# EAGLE design bal_part (EAGLE 7.2.0)
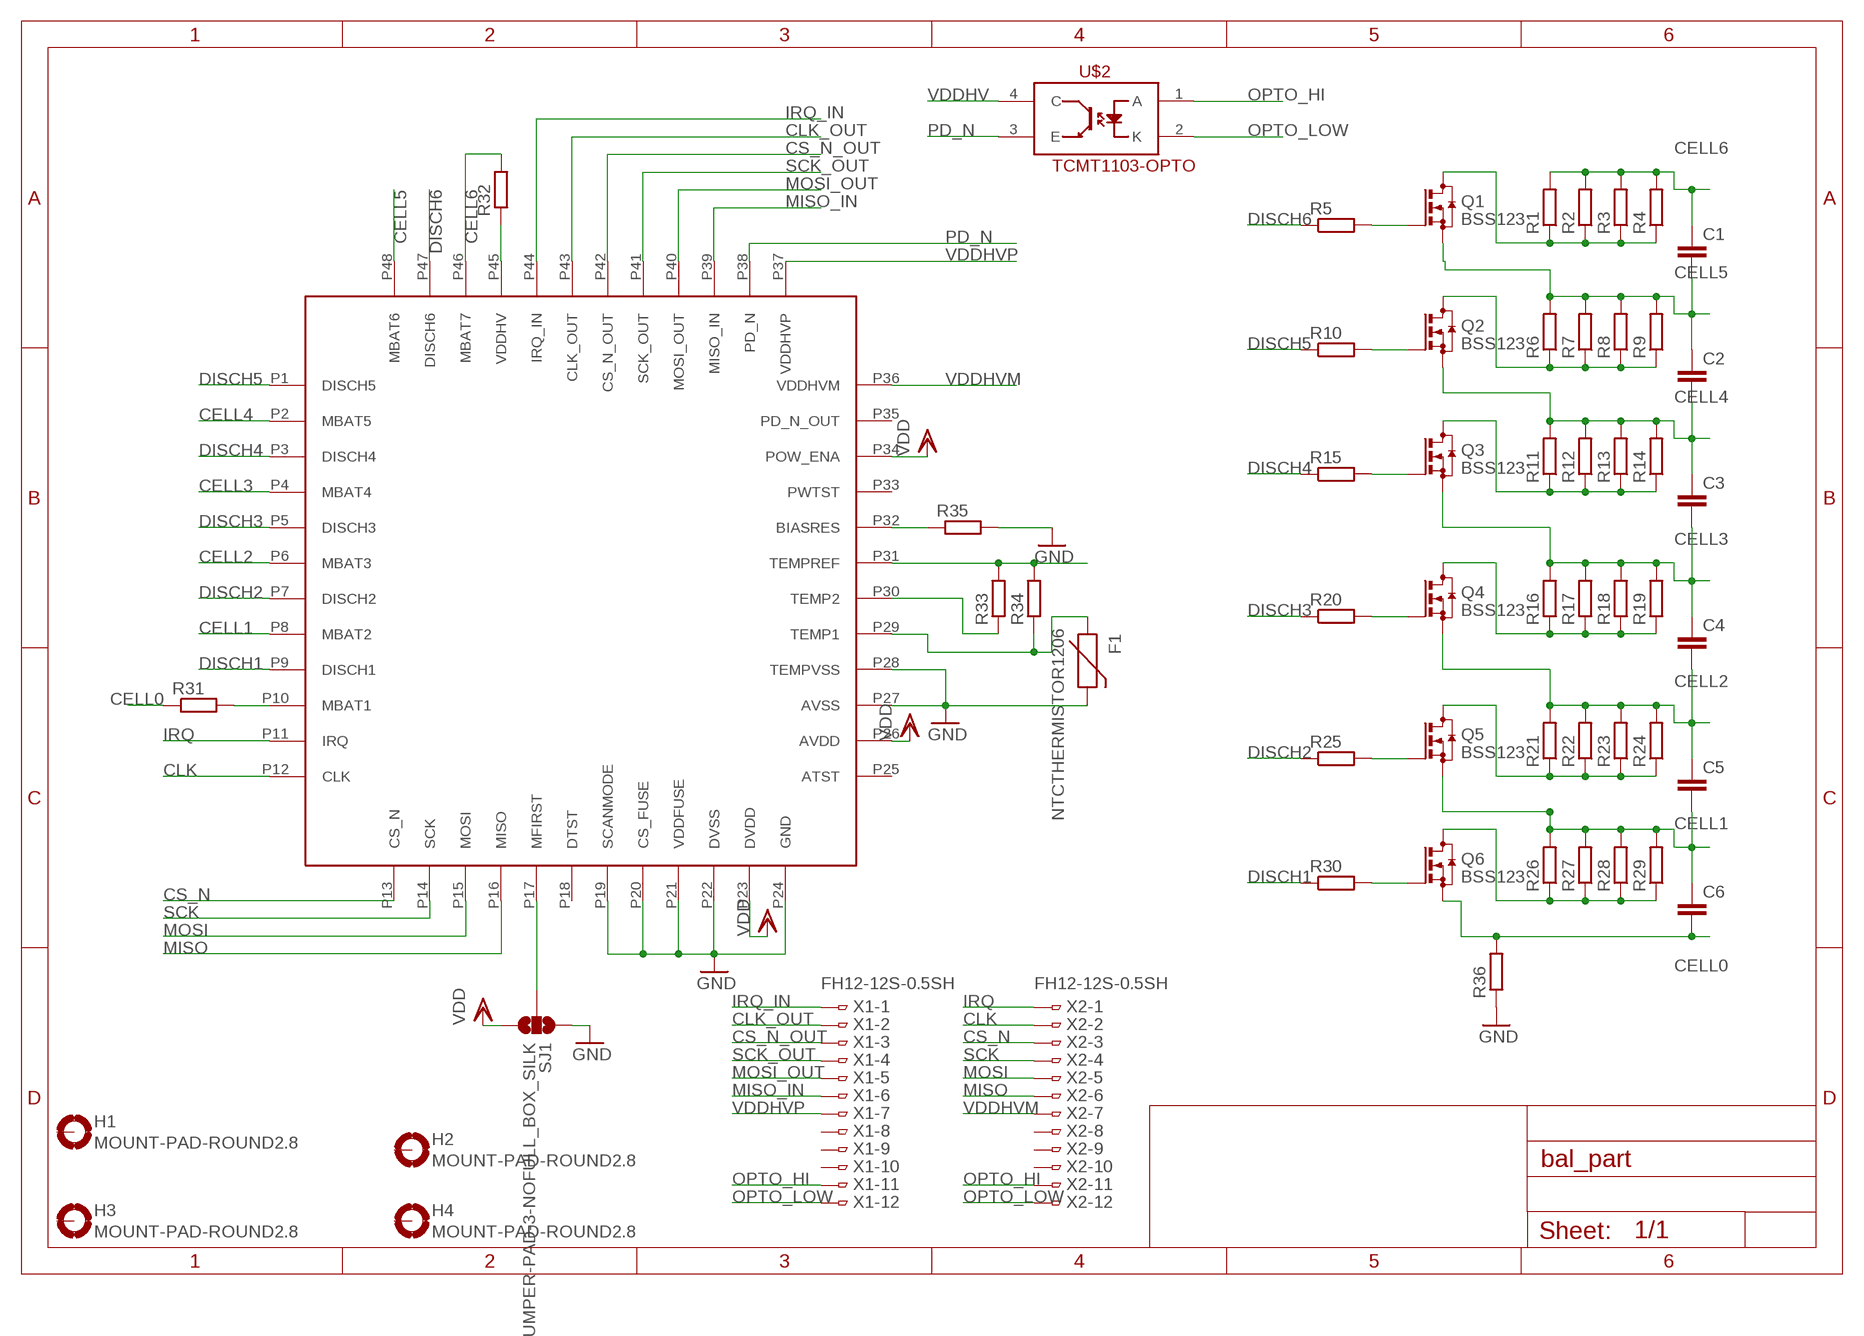
[diagram p0: schematic, sheet 1]

## Parts
C1  C-EUC0805  [C0805]
C2  C-EUC0805  [C0805]
C3  C-EUC0805  [C0805]
C4  C-EUC0805  [C0805]
C5  C-EUC0805  [C0805]
C6  C-EUC0805  [C0805]
F1  NTCTHERMISTOR1206  PTCTHERMISTOR1206  [PTC-1206]
H1  MOUNT-PAD-ROUND2.8  [2,8-PAD]
H2  MOUNT-PAD-ROUND2.8  [2,8-PAD]
H3  MOUNT-PAD-ROUND2.8  [2,8-PAD]
H4  MOUNT-PAD-ROUND2.8  [2,8-PAD]
Q1  BSS123  [SOT23]
Q2  BSS123  [SOT23]
Q3  BSS123  [SOT23]
Q4  BSS123  [SOT23]
Q5  BSS123  [SOT23]
Q6  BSS123  [SOT23]
R1  R-EU_R1206  [R1206]
R2  R-EU_R1206  [R1206]
R3  R-EU_R1206  [R1206]
R4  R-EU_R1206  [R1206]
R5  R-EU_R0805  [R0805]
R6  R-EU_R1206  [R1206]
R7  R-EU_R1206  [R1206]
R8  R-EU_R1206  [R1206]
R9  R-EU_R1206  [R1206]
R10  R-EU_R0805  [R0805]
R11  R-EU_R1206  [R1206]
R12  R-EU_R1206  [R1206]
R13  R-EU_R1206  [R1206]
R14  R-EU_R1206  [R1206]
R15  R-EU_R0805  [R0805]
R16  R-EU_R1206  [R1206]
R17  R-EU_R1206  [R1206]
R18  R-EU_R1206  [R1206]
R19  R-EU_R1206  [R1206]
R20  R-EU_R0805  [R0805]
R21  R-EU_R1206  [R1206]
R22  R-EU_R1206  [R1206]
R23  R-EU_R1206  [R1206]
R24  R-EU_R1206  [R1206]
R25  R-EU_R0805  [R0805]
R26  R-EU_R1206  [R1206]
R27  R-EU_R1206  [R1206]
R28  R-EU_R1206  [R1206]
R29  R-EU_R1206  [R1206]
R30  R-EU_R0805  [R0805]
R31  R-EU_R0805  [R0805]
R32  R-EU_R0805  [R0805]
R33  R-EU_R0805  [R0805]
R34  R-EU_R0805  [R0805]
R35  R-EU_R0805  [R0805]
R36  R-EU_R0805  [R0805]
SJ1  JUMPER-PAD-3-NOFULL_BOX_SILK  [PAD-JUMPER-3-NO_YES_SILK_FULL_BOX]
U$1  ATA6870  [QFN48]
U$2  TCMT1103-OPTO  [SSOP-4]
X1  FH12-12S-0.5SH  [FH12-12S-0.5SH]
X2  FH12-12S-0.5SH  [FH12-12S-0.5SH]

## Nets
CELL0: C6.2 Q6.2(S) R31.1 R36.2
CELL1: C5.2 C6.1 Q5.2(S) R26.2 R27.2 R28.2 R29.2 U$1.P8(MBAT2)
CELL2: C4.2 C5.1 Q4.2(S) R21.2 R22.2 R23.2 R24.2 U$1.P6(MBAT3)
CELL3: C3.2 C4.1 Q3.2(S) R16.2 R17.2 R18.2 R19.2 U$1.P4(MBAT4)
CELL4: C2.2 C3.1 Q2.2(S) R11.2 R12.2 R13.2 R14.2 U$1.P2(MBAT5)
CELL5: C1.2 C2.1 Q1.2(S) R6.2 R7.2 R8.2 R9.2 U$1.P48(MBAT6)
CELL6: C1.1 R1.2 R2.2 R3.2 R4.2 R32.2 U$1.P46(MBAT7)
CLK: U$1.P12(CLK) X2.2
CLK_OUT: U$1.P43(CLK_OUT) X1.2
CS_N: U$1.P13(CS_N) X2.3
CS_N_OUT: U$1.P42(CS_N_OUT) X1.3
DISCH1: R30.1 U$1.P9(DISCH1)
DISCH2: R25.1 U$1.P7(DISCH2)
DISCH3: R20.1 U$1.P5(DISCH3)
DISCH4: R15.1 U$1.P3(DISCH4)
DISCH5: R10.1 U$1.P1(DISCH5)
DISCH6: R5.1 U$1.P47(DISCH6)
GND: F1.2 R35.2 R36.1 SJ1.1 U$1.P19(SCANMODE) U$1.P20(CS_FUSE) U$1.P21(VDDFUSE) U$1.P22(DVSS) U$1.P24(GND) U$1.P27(AVSS) U$1.P28(TEMPVSS)
IRQ: U$1.P11(IRQ) X2.1
IRQ_IN: U$1.P44(IRQ_IN) X1.1
MISO: U$1.P16(MISO) X2.6
MISO_IN: U$1.P39(MISO_IN) X1.6
MOSI: U$1.P15(MOSI) X2.5
MOSI_OUT: U$1.P40(MOSI_OUT) X1.5
N$1: Q1.3(D) R1.1 R2.1 R3.1 R4.1
N$2: Q1.1(G) R5.2
N$3: Q2.3(D) R6.1 R7.1 R8.1 R9.1
N$4: Q2.1(G) R10.2
N$5: Q3.3(D) R11.1 R12.1 R13.1 R14.1
N$6: Q3.1(G) R15.2
N$7: Q4.3(D) R16.1 R17.1 R18.1 R19.1
N$8: Q4.1(G) R20.2
N$9: Q5.3(D) R21.1 R22.1 R23.1 R24.1
N$10: Q5.1(G) R25.2
N$11: Q6.3(D) R26.1 R27.1 R28.1 R29.1
N$12: Q6.1(G) R30.2
N$13: R31.2 U$1.P10(MBAT1)
N$15: R33.2 R34.2 U$1.P31(TEMPREF)
N$16: R33.1 U$1.P30(TEMP2)
N$17: F1.1 R34.1 U$1.P29(TEMP1)
N$18: R35.1 U$1.P32(BIASRES)
N$19: SJ1.2 U$1.P17(MFIRST)
OPTO_HI: U$2.1(A) X1.11 X2.11
OPTO_LOW: U$2.2(K) X1.12 X2.12
PD_N: U$1.P38(PD_N) U$2.3(E)
SCK: U$1.P14(SCK) X2.4
SCK_OUT: U$1.P41(SCK_OUT) X1.4
VDD: SJ1.3 U$1.P23(DVDD) U$1.P26(AVDD) U$1.P34(POW_ENA)
VDDHV: R32.1 U$1.P45(VDDHV) U$2.4(C)
VDDHVM: U$1.P36(VDDHVM) X2.7
VDDHVP: U$1.P37(VDDHVP) X1.7
Unconnected: H1.B2,8(MOUNT) H2.B2,8(MOUNT) H3.B2,8(MOUNT) H4.B2,8(MOUNT) U$1.P18(DTST) U$1.P25(ATST) U$1.P33(PWTST) U$1.P35(PD_N_OUT) X1.8 X1.9 X1.10 X2.8 X2.9 X2.10

## Library data of the parts
C1-C6 = resistor:C-EU: CAPACITOR, European symbol
F1 = SparkFun-PowerIC:PTC: Resettable Fuse PTC Resettable Fuse. Spark Fun Electronics SKU : COM-08357; PROD_ID: RES-08585
H1-H4 = holes:MOUNT-PAD-ROUND: MOUNTING PAD, round
Q1-Q6 = transistor-small-signal:BSS123: N-CHANNEL MOS FET
R1-R4 R6-R9 R11-R14 R16-R19 R21-R24 R26-R29 = rcl:R-EU_: RESISTOR, European symbol
R5 R10 R15 R20 R25 R30-R36 = resistor:R-EU_: RESISTOR, European symbol
SJ1 = SparkFun-Passives:JUMPER-PAD-3-NO
U$1 = myLib:ATA6870: ATA6870-PLQW Battery Management 48QFN
U$2 = SparkFun-DiscreteSemi:TCMT1103-OPTO: Optoisolator- NPN output
X1 X2 = con-hirose:FH12-12S-0.5S: 0.5mm Pitch Connectors For FPC/FFC Source: Data sheet <http://www.hirose.co.jp/cataloge_hp/e58605370.pdf>; MPN: FH12-12S-0.5SH(55); OC_FARNELL: 1324542; OC_NEWARK: 34M6155

## Board
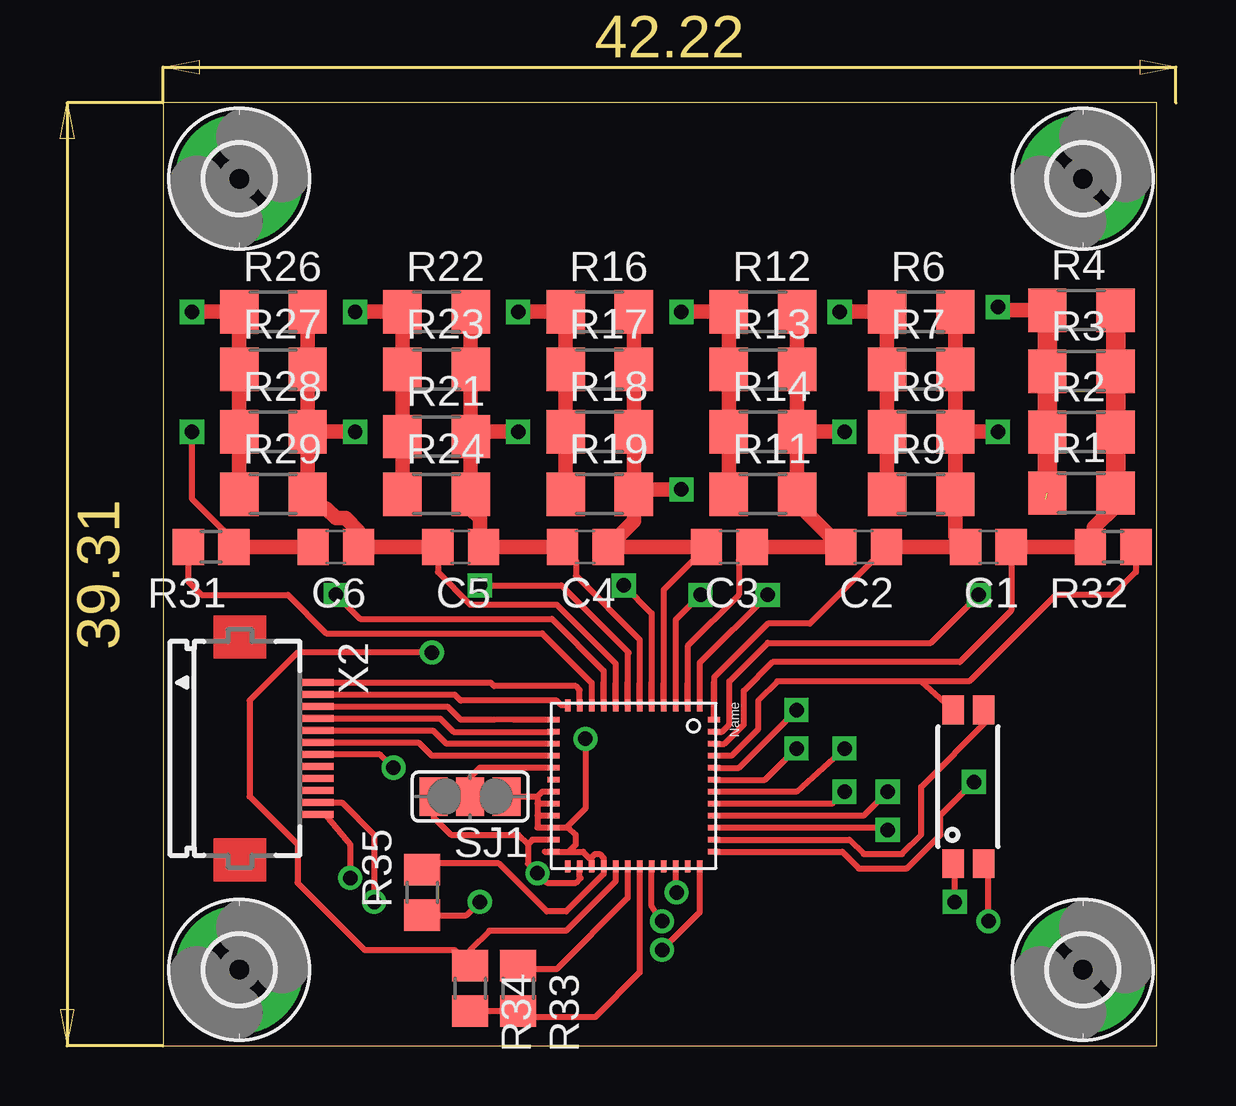
[diagram p1: board, top side]
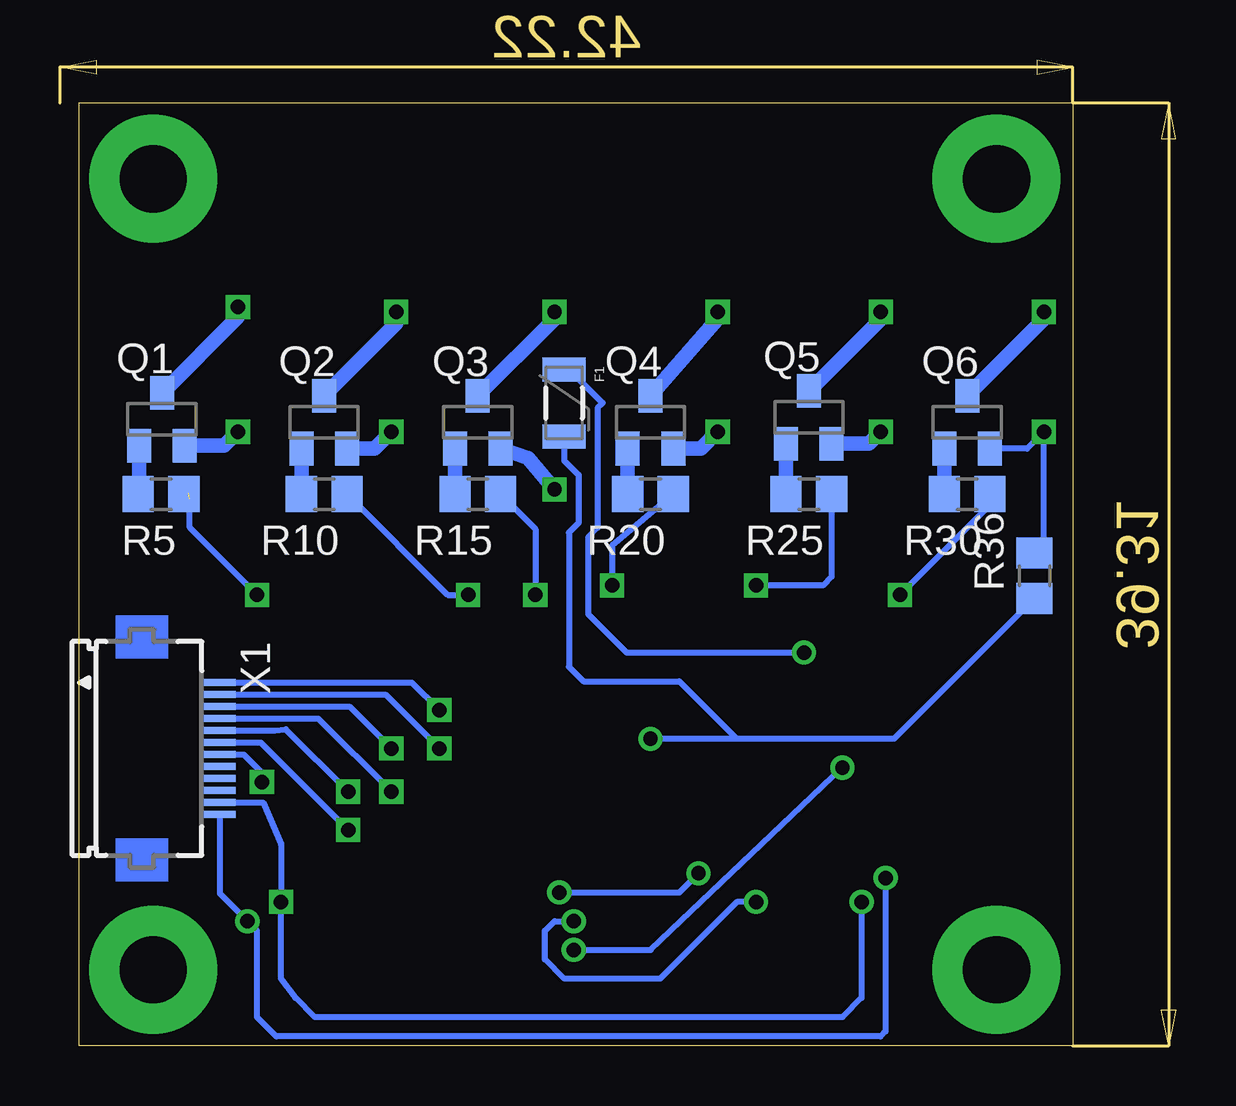
[diagram p2: board, bottom side, seen from below]

Size 41.41 x 39.31 mm. Coordinates in mm from the lower left corner, seen from the top.
Outline: 0,0 41.41,0 41.41,39.31 0,39.31 0,0
Copper layers (1*16): Top 0.035mm / dielectric 1.5mm / Bottom 0.035mm
Design rules "default": minimum track width 10mil, minimum drill 24mil, track to track 8mil, track to pad 8mil, pad to pad 8mil, via to via 8mil, smd to smd 8mil, copper to edge 40mil, drill to drill 8mil, minimum pad ring 10mil, minimum via ring 8mil, stop-mask expansion 4mil, vias tented up to drill 0mil, thermal gap 10mil

### Footprints (pad centres in the part's own frame; a part is rotated, then mirrored left to right if it is on the bottom)
C0805 = smd 1.3 x 1.5: 1 -0.95,0; 2 0.95,0
PTC-1206 = smd 1 x 1.8: 1 -1.4,0; 2 1.4,0
2,8-PAD = drill 2.8 pad 5.334: B2,8 0,0
SOT23 = smd 1 x 1.4: 1 -0.95,-1.1; 2 0.95,-1.1; 3 0,1.1
R1206 = smd 1.6 x 1.803: 1 -1.422,0; 2 1.422,0
R0805 = smd 1.3 x 1.5: 1 -0.95,0; 2 0.95,0
PAD-JUMPER-3-NO_YES_SILK_FULL_BOX = smd 1.168 x 1.6: 1 -1.524,0; 2 0,0; 3 1.524,0
QFN48 = smd 0.5 x 0.23: P1 -3.35,2.75; P2 -3.35,2.25; P3 -3.35,1.75; P4 -3.35,1.25; P5 -3.35,0.75; P6 -3.35,0.25; P7 -3.35,-0.25; P8 -3.35,-0.75; P9 -3.35,-1.25; P10 -3.35,-1.75; P11 -3.35,-2.25; P12 -3.35,-2.75; P25 3.35,-2.75; P26 3.35,-2.25; P27 3.35,-1.75; P28 3.35,-1.25; P29 3.35,-0.75; P30 3.35,-0.25; P31 3.35,0.25; P32 3.35,0.75; P33 3.35,1.25; P34 3.35,1.75; P35 3.35,2.25; P36 3.35,2.75 | smd 0.23 x 0.5: P13 -2.75,-3.35; P14 -2.25,-3.35; P15 -1.75,-3.35; P16 -1.25,-3.35; P17 -0.75,-3.35; P18 -0.25,-3.35; P19 0.25,-3.35; P20 0.75,-3.35; P21 1.25,-3.35; P22 1.75,-3.35; P23 2.25,-3.35; P24 2.75,-3.35; P37 2.75,3.35; P38 2.25,3.35; P39 1.75,3.35; P40 1.25,3.35; P41 0.75,3.35; P42 0.25,3.35; P43 -0.25,3.35; P44 -0.75,3.35; P45 -1.25,3.35; P46 -1.75,3.35; P47 -2.25,3.35; P48 -2.75,3.35
SSOP-4 = smd 1.2 x 0.9: 1 -3.2,0.67; 2 -3.2,-0.6; 3 3.2,-0.6; 4 3.2,0.67
FH12-12S-0.5SH = smd 0.3 x 1.3: 1 -2.75,3.25; 2 -2.25,3.25; 3 -1.75,3.25; 4 -1.25,3.25; 5 -0.75,3.25; 6 -0.25,3.25; 7 0.25,3.25; 8 0.75,3.25; 9 1.25,3.25; 10 1.75,3.25; 11 2.25,3.25; 12 2.75,3.25

### Placement (x,y rotation side)
C1  34.4,20.8 180 top
C2  29.2,20.8 180 top
C3  23.6,20.8 180 top
C4  17.6,20.8 180 top
C5  12.4,20.8 180 top
C6  7.2,20.8 180 top
F1  21.2,26.8 270 bottom
H1  3.17,36.15 0 top
H2  3.17,3.17 0 top
H3  38.34,3.17 0 top
H4  38.34,36.15 0 top
Q1  37.97,26.12 0 bottom
Q2  31.2,26 0 bottom
Q3  24.8,26 0 bottom
Q4  17.6,26 0 bottom
Q5  11,26.2 0 bottom
Q6  4.4,26 0 bottom
R1  38.28,23.05 0 top
R2  38.28,25.59 0 top
R3  38.28,28.12 0 top
R4  38.28,30.66 0 top
R5  38,23 180 bottom
R6  31.6,30.6 0 top
R7  31.6,28.2 0 top
R8  31.6,25.6 0 top
R9  31.6,23 0 top
R10  31.2,23 180 bottom
R11  25,23 0 top
R12  25,30.6 0 top
R13  25,28.2 0 top
R14  25,25.6 0 top
R15  24.8,23 180 bottom
R16  18.2,30.6 0 top
R17  18.2,28.2 0 top
R18  18.2,25.6 0 top
R19  18.2,23 0 top
R20  17.6,23 180 bottom
R21  11.4,25.4 0 top
R22  11.4,30.6 0 top
R23  11.4,28.2 0 top
R24  11.4,23 0 top
R25  11,23 180 bottom
R26  4.6,30.6 0 top
R27  4.6,28.2 0 top
R28  4.6,25.6 0 top
R29  4.6,23 0 top
R30  4.4,23 180 bottom
R31  2,20.8 180 top
R32  39.6,20.8 180 top
R33  14.8,2.4 270 top
R34  12.8,2.4 270 top
R35  10.8,6.4 90 top
R36  1.6,19.6 90 bottom
SJ1  12.8,10.4 180 top
U$1  19.61,10.85 270 top
U$2  33.6,10.8 90 top
X1  38.8,12.4 270 bottom
X2  3.2,12.4 270 top

### Tracks (layer width: path | path; a pad name or v marks a point on that pad's centre or on a via)
CELL0  (via drill 0.6)
  Top 0.254: R31.1 2.95,21.05 1.2,22.8 v1.2,25.6
  Top 0.61: C6.2 R31.1
  Bottom 0.254: Q6.2 1.9,24.9 v1.2,25.6 1.2,20.95 R36.2
CELL1  (via drill 0.6)
  Top 0.254: 18.86,15.13 U$1.P8 18.86,15.94 16.4,18.4 12.8,18.4 11.45,19.75 C5.2
  Top 0.61: R26.2 R27.2 R28.2 | R28.2 R29.2 6.62,22.4 6.8,22.4 7.2,22 7.6,22 8.15,21.45 C6.1 C5.2 | v8,25.6 R28.2
  Bottom 0.61: Q5.2 8.5,25.1 v8,25.6
CELL2  (via drill 0.6)
  Top 0.254: 19.86,15.13 U$1.P6 19.86,16.93 17.2,19.6 17.2,20.25 C4.2
  Top 0.61: R22.2 R23.2 R21.2 | R21.2 R24.2 12.82,22.38 13.2,22 13.2,20.95 C5.1 C4.2 | v14.8,25.6 13.02,25.6 R21.2
  Bottom 0.61: Q4.2 15.5,24.9 v14.8,25.6
CELL3  (via drill 0.6)
  Top 0.254: 20.86,15.13 U$1.P4 20.86,19.02 C3.2
  Top 0.61: R16.2 R17.2 R18.2 R19.2 | R19.2 19.62,21.87 C4.1 C3.2 | v21.6,23.2 19.82,23.2 R19.2
  Bottom 0.61: Q3.2 22.7,24.5 v21.6,23.2
CELL4  (via drill 0.6)
  Top 0.254: 21.86,15.13 U$1.P2 21.86,16.66 24,18.8 24,20.25 C3.1
  Top 0.61: R12.2 R13.2 R14.2 | R14.2 R11.2 26.42,22.63 C2.2 C3.1 | v28.4,25.6 R14.2
  Bottom 0.61: Q2.2 29.1,24.9 v28.4,25.6
CELL5  (via drill 0.6)
  Top 0.254: 22.96,15.16 U$1.P48 22.96,15.37 25.2,17.6 26.95,17.6 C2.1
  Top 0.61: R6.2 R7.2 R8.2 | R8.2 R9.2 33.02,21.23 C1.2 C2.1 | v34.8,25.6 R8.2
  Bottom 0.61: Q1.2 35.38,25.02 v34.8,25.6
CELL6
  Top 0.254: U$1.P46 23.39,12.6 24.2,13.4 24.2,14.8 25.4,16 33.2,16 35.35,18.15 C1.1
  Top 0.61: R1.2 39.7,22.5 38.8,21.6 38.8,20.95 R32.2 C1.1
  Top 0.813: R4.2 R3.2 R2.2 R1.2
CLK
  Top 0.254: U$1.P12 16.61,14.2 16.4,14.4 12.4,14.4 12.15,14.65 X2.2
CLK_OUT  (via drill 0.6)
  Top 0.254: U$1.P43 25.09,11.1 v26.4,12.4
  Bottom 0.254: X1.2 28.65,14.65 v26.4,12.4
CS_N
  Top 0.254: U$1.P13 14.61,13.6 13.8,13.6 12.4,13.6 11.85,14.15 X2.3
CS_N_OUT  (via drill 0.6)
  Top 0.254: v28.4,12.4 26.39,10.6 U$1.P42
  Bottom 0.254: X1.3 30.15,14.15 v28.4,12.4
DISCH1  (via drill 0.6)
  Top 0.254: 18.36,15.16 U$1.P9 18.36,15.63 16.2,17.8 8.2,17.8 v7.2,18.8
  Bottom 0.254: R30.1 3.45,22.55 v7.2,18.8
DISCH2  (via drill 0.6)
  Top 0.254: 19.36,15.16 U$1.P7 19.36,16.36 19.4,16.4 16.6,19.2 v13.2,19.2
  Bottom 0.254: R25.1 10.05,19.55 10.4,19.2 v13.2,19.2
DISCH3  (via drill 0.6)
  Top 0.254: 20.36,15.16 U$1.P5 20.36,18.04 v19.2,19.2
  Bottom 0.254: R20.1 19.2,20.85 v19.2,19.2
DISCH4  (via drill 0.6)
  Top 0.254: v22.4,18.8 21.36,17.77 U$1.P3
  Bottom 0.254: R15.1 22.4,21.55 v22.4,18.8
DISCH5  (via drill 0.6)
  Top 0.254: v25.2,18.8 22.36,15.96 U$1.P1
  Bottom 0.254: R10.1 26.05,18.8 v25.2,18.8
DISCH6  (via drill 0.6)
  Top 0.254: U$1.P47 23.3,13.1 23.6,13.4 23.6,15.2 25.2,16.8 32,16.8 v34,18.8
  Bottom 0.254: v34,18.8 36.8,21.6 36.8,22.75 R5.1
GND  (via drill 0.6)
  Top 0.254: U$1.P19 15.79,10.6 15.6,10.4 | 15.6,10.4 15.6,10.1 | 15.6,10.1 15.6,9.6 | 15.6,9.6 15.6,9.1 U$1.P22 16.8,9.1 | 15.9,8.1 U$1.P24 | U$1.P20 15.6,10.1 | U$1.P21 15.6,9.6 | SJ1.1 15.6,10.4 | U$1.P24 16.89,8.1 17.2,8.4 17.2,8.8 16.91,9.1 16.8,9.1 | U$1.P24 17.5,8.1 17.86,7.74 U$1.P27 17.86,7.87 18,8 18.2,8 18.36,7.83 U$1.P28 18.36,7.17 16.8,5.6 16,5.6 14,7.6 11.05,7.6 R35.2 | v17.6,12.8 17.6,9.89 16.8,9.1
  Bottom 0.254: F1.2 21.2,24.4 20.6,23.8 20.6,21.8 21,21.4 21,15.8 20.4,15.2 16.4,15.2 14,12.8 | R36.1 7.45,12.8 14,12.8 | 14,12.8 v17.6,12.8
IRQ
  Top 0.254: U$1.P11 17.36,14.84 17.2,15 13.8,15 13.65,15.15 X2.1
IRQ_IN  (via drill 0.6)
  Top 0.254: U$1.P44 24,11.6 v26.4,13.99 v26.4,14
  Bottom 0.254: X1.1 27.55,15.15 v26.4,14
MISO
  Top 0.254: U$1.P16 11.2,12.1 10.64,12.65 X2.6
MISO_IN  (via drill 0.6)
  Top 0.254: v30.2,9 30.09,9.1 U$1.P39
  Bottom 0.254: X1.6 33.85,12.65 v30.2,9
MOSI
  Top 0.254: U$1.P15 11.8,12.6 11.25,13.15 X2.5
MOSI_OUT  (via drill 0.6)
  Top 0.254: v30.2,10.6 29.2,9.6 U$1.P40
  Bottom 0.254: X1.5 33.25,13.15 32.8,13.2 v30.2,10.6
N$1  (via drill 0.6)  (1 unrouted)
  Top 0.254: 36.77,22.42 36.8,22.42 36.8,22.8
  Top 0.61: v34.8,30.8 34.94,30.66 R4.1
  Top 0.813: R4.1 R3.1 R2.1 R1.1
  Bottom 0.61: Q1.3 34.8,30.39 v34.8,30.8
N$2
  Bottom 0.61: R5.2 38.91,23.04 Q1.1
N$3  (via drill 0.6)
  Top 0.61: R9.1 R8.1 R7.1 R6.1 v28.2,30.6
  Bottom 0.61: Q2.3 28.2,30.1 v28.2,30.6
N$4
  Bottom 0.61: R10.2 Q2.1
N$5  (via drill 0.6)
  Top 0.61: R11.1 R14.1 R13.1 R12.1 v21.6,30.6
  Bottom 0.61: Q3.3 21.6,30.3 v21.6,30.6
N$6
  Bottom 0.61: R15.2 Q3.1
N$7  (via drill 0.6)
  Top 0.61: R19.1 R18.1 R17.1 R16.1 v14.8,30.6
  Bottom 0.61: Q4.3 14.8,30.3 v14.8,30.6
N$8
  Bottom 0.61: R20.2 Q4.1
N$9  (via drill 0.6)
  Top 0.61: R24.1 R21.1 R23.1 R22.1 v8,30.6
  Bottom 0.61: Q5.3 8,30.3 v8,30.6
N$10
  Bottom 0.61: R25.2 Q5.1
N$11  (via drill 0.6)
  Top 0.61: R29.1 R28.1 R27.1 R26.1 v1.2,30.6
  Bottom 0.61: Q6.3 1.2,30.3 v1.2,30.6
N$12
  Bottom 0.61: R30.2 Q6.1
N$13
  Top 0.254: U$1.P10 17.86,15.13 15.8,17.2 6.8,17.2 5.2,18.8 1.6,18.8 1.05,19.35 R31.2
N$15
  Top 0.254: U$1.P31 19.86,3.06 18,1.2 15.05,1.2 R33.2 R34.2
N$16
  Top 0.254: U$1.P30 19.36,6.17 16.4,3.2 14.95,3.2 R33.1
N$17  (via drill 0.6)
  Top 0.254: U$1.P29 18.86,6.87 16.8,4.8 13.6,4.8 12.8,4 R34.1 12.15,4 8.4,4 5.6,6.8 5.6,8.4 3.6,10.4 3.6,14.4 5.6,16.4 v11.2,16.4
  Bottom 0.254: F1.1 21,28.2 19.6,26.8 19.8,26.6 19.8,21.6 20.2,21.2 20.2,18 18.6,16.4 v11.2,16.4
N$18  (via drill 0.6)
  Top 0.254: R35.1 12.65,5.45 v13.2,6 | v20.8,5.2 20.36,5.83 U$1.P32
  Bottom 0.254: v13.2,6 14,6 17.2,2.8 21.2,2.8 22,3.6 22,4.8 21.6,5.2 v20.8,5.2
N$19
  Top 0.254: U$1.P17 13.2,11.6 12.8,11.2 SJ1.2
OPTO_HI  (via drill 0.6)
  Top 0.254: v33,6 33,7.47 U$2.1 | X2.11 7.45,10.15 8.8,8.8 v8.8,6
  Bottom 0.254: X1.11 33.75,10.15 33,8.4 v33,6 33,2.8 32.4,2 31.6,1.2 9.6,1.2 8.8,2 v8.8,6
OPTO_LOW  (via drill 0.6)
  Top 0.254: X2.12 6.75,9.65 7.8,8.4 v7.8,7 | v34.4,5.2 34.4,7.4 U$2.2
  Bottom 0.254: v7.8,7 7.8,0.6 8,0.4 33.2,0.4 34,1.2 34,4.8 v34.4,5.2 35.55,6.35 X1.12
PD_N
  Top 0.254: U$1.P38 28.61,8.6 29.2,8 30.8,8 31.6,8.8 31.6,10.8 34.4,13.6 34.4,14.2 U$2.3
SCK
  Top 0.254: X2.4 11.55,13.65 12.11,13.1 U$1.P14
SCK_OUT  (via drill 0.6)
  Top 0.254: v28.4,10.6 27.89,10.1 U$1.P41
  Bottom 0.254: X1.4 31.45,13.65 v28.4,10.6
VDD  (via drill 0.6)
  Top 0.254: U$1.P23 15.39,8.6 15.2,8.4 | 15.2,8.4 15.2,7.6 v15.6,7.2 16,6.8 17.2,6.8 17.4,7 17.36,7.04 U$1.P26 | U$1.P34 21.36,6.83 v21.4,6.4 | SJ1.3 11.28,9.52 12,8.8 14.8,8.8 15.2,8.4
  Bottom 0.254: v21.4,6.4 16.4,6.4 v15.6,7.2
VDDHV
  Top 0.254: R32.1 40.55,19.75 39.6,18.8 37.2,18.8 33.6,15.2 31.6,15.2 | 31.6,15.2 25.6,15.2 24.8,14.4 24.8,13.2 23.7,12.1 U$1.P45 | U$2.4 32.8,14.13 31.6,15.2
VDDHVM  (via drill 0.6)
  Top 0.254: U$1.P36 22.36,5.57 v20.8,4 | v9.6,11.6 9.05,12.15 X2.7
  Bottom 0.254: v20.8,4 17.6,4 v9.6,11.6
VDDHVP  (via drill 0.6)
  Top 0.254: U$1.P37 28.3,8.1 29,7.4 31,7.4 32.4,8.8 32.4,9.6 v33.8,11
  Bottom 0.254: X1.7 34.55,12.15 33.8,11.4 v33.8,11